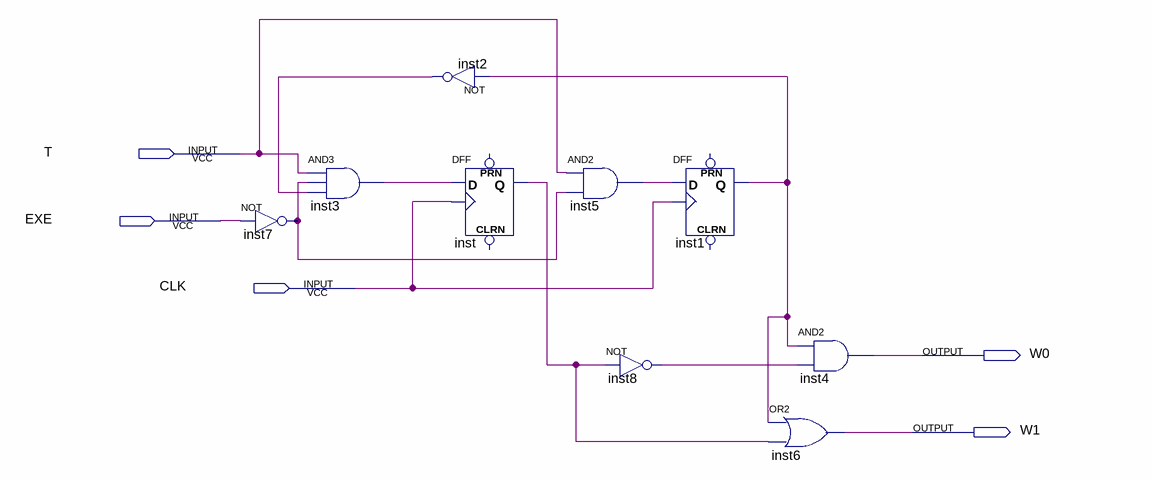
[diagram p0: schematic sheet]
// Quartus schematic Maquina_estado.bdf as structural Verilog: 9 symbols, 5 pins
module Maquina_estado (
  input  T,
  input  EXE,
  input  CLK,
  output W0,
  output W1
);

  wire inst1_q, inst2_out, inst3_out, inst5_out, inst7_out, inst8_out, inst_q;

  not inst7 (inst7_out, EXE);
  and inst3 (inst3_out, T, inst7_out, inst2_out);
  not inst2 (inst2_out, inst1_q);
  DFF inst (.CLK(CLK), .D(inst3_out), .Q(inst_q));  // open: CLRN, PRN
  and inst5 (inst5_out, T, inst7_out);
  not inst8 (inst8_out, inst_q);
  DFF inst1 (.CLK(CLK), .D(inst5_out), .Q(inst1_q));  // open: CLRN, PRN
  and inst4 (W0, inst1_q, inst8_out);
  or inst6 (W1, inst1_q, inst_q);
endmodule
